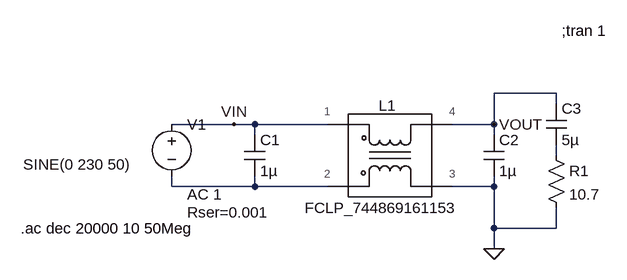
[diagram p0: schematic EMI_IN_FILT_DM_DAMPING.asc]
EMI_IN_FILT_DM_DAMPING.asc, the LTspice schematic file:
Version 4
SHEET 1 1160 680
WIRE 416 64 320 64
WIRE 416 80 416 64
WIRE -80 112 -176 112
WIRE -48 112 -80 112
WIRE 64 112 -48 112
WIRE 320 112 320 64
WIRE 320 112 256 112
WIRE -48 128 -48 112
WIRE 320 128 320 112
WIRE 416 160 416 144
WIRE -176 208 -176 192
WIRE -48 208 -48 192
WIRE -48 208 -176 208
WIRE 64 208 -48 208
WIRE 320 208 320 192
WIRE 320 208 256 208
WIRE 320 272 320 208
WIRE 416 272 416 240
WIRE 416 272 320 272
WIRE 320 304 320 272
FLAG 320 304 0
FLAG -80 112 VIN
FLAG 320 112 VOUT
SYMBOL Contrib\\Wurth\\EMC-Components\\CommonModeChokes\\WE-FCLP 160 160 R0
SYMATTR InstName L1
SYMATTR SpiceModel FCLP_744869161153
SYMBOL voltage -176 96 R0
WINDOW 3 -228 78 Left 2
WINDOW 123 24 124 Left 2
WINDOW 39 24 152 Left 2
SYMATTR Value SINE(0 230 50)
SYMATTR Value2 AC 1
SYMATTR SpiceLine Rser=0.001
SYMATTR InstName V1
SYMBOL cap 304 128 R0
SYMATTR InstName C2
SYMATTR Value 1µ
SYMATTR SpiceLine V=310 Irms=0 Rser=0.002 Lser=13.1n
SYMBOL cap -64 128 R0
SYMATTR InstName C1
SYMATTR Value 1µ
SYMATTR SpiceLine V=310 Irms=0 Rser=0.002 Lser=13.1n
SYMBOL cap 400 80 R0
SYMATTR InstName C3
SYMATTR Value 5µ
SYMBOL res 400 144 R0
SYMATTR InstName R1
SYMATTR Value 10.7
TEXT -408 272 Left 2 !.ac dec 20000 10 50Meg
TEXT 424 -32 Left 2 !;tran 1

The netlist it stands for:
* EMI_IN_FILT_DM_DAMPING.asc
XL1 VIN N002 0 VOUT FCLP_744869161153  ; pins 1 2 3 4
V1 VIN N002 SINE(0 230 50) AC 1 Rser=0.001
C2 VOUT 0 1µ V=310 Irms=0 Rser=0.002 Lser=13.1n
C1 VIN N002 1µ V=310 Irms=0 Rser=0.002 Lser=13.1n
C3 VOUT N001 5µ
R1 N001 0 10.7
.ac dec 20000 10 50Meg
;tran 1
.lib WE-FCLP.lib
.backanno
.end